# Altium schematic sheet USB.SchDoc
size A4
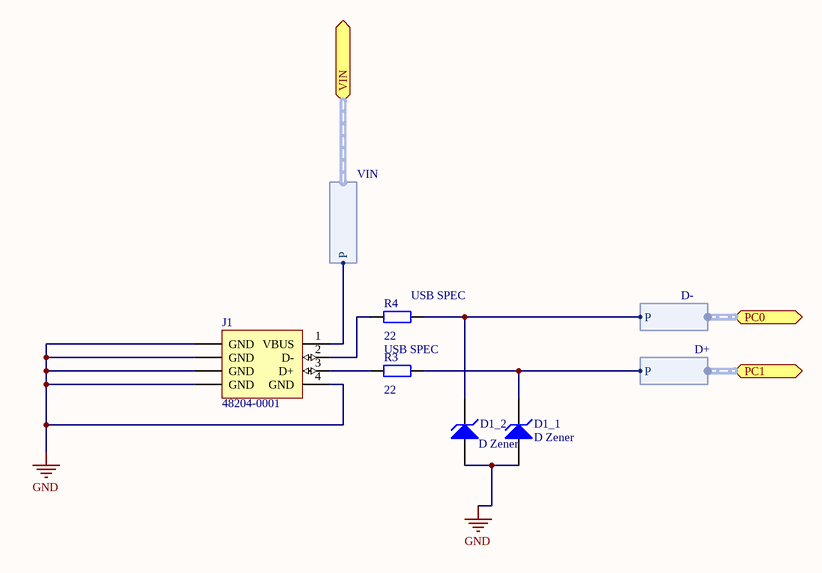
[diagram p0: USB.SchDoc]

## Parts
D1_1  D Zener  [DIODE-0.7]
D1_2  D Zener  [DIODE-0.7]
J1  48204-0001  [MOLX-48204-0001_V]
R3  USB SPEC  value 22  [AXIAL-0.4]
R4  USB SPEC  value 22  [AXIAL-0.4]

## Ports
PC0 (harness D-), PC1 (harness D+), VIN (harness VIN)

## Harnesses
VIN: P
D-: P
D+: P

## Nets
GND: D1_1.1(A) D1_2.1(A) J1.4(GND) J1.5(GND) J1.6(GND) J1.7(GND) J1.8(GND)
NetD1_1_2: D1_1.2(K) R3.2 ; port PC1.P
NetD1_2_2: D1_2.2(K) R4.2 ; port PC0.P
NetJ1_1: J1.1(VBUS) ; port VIN.P
NetJ1_2: J1.2(D-) R4.1
NetJ1_3: J1.3(D+) R3.1

## Library data of the parts
D1_1 D1_2 = D Zener: Zener Diode; Published: 8-Jun-2000; LatestRevisionDate: 17-Jul-2002; LatestRevisionNote: Re-released for DXP Platform.; PackageReference: DIODE-0.7; Publisher: Altium Limited; PackageDescription: Diode, Thru-Hole; 2 Leads; 0.7 in Pin Spacing
J1 = CMP-0411-00001-1: USB Shielded I/O Receptacle, Type A; Manufacturer: Molex; Required PB Thickness: 1.6 mm; ComponentLink1URL: http://www.molex.com/; PackageDescription: USB Type-A Up-Right Reverse Connector; PartNumber: 48204-0001; DatasheetVersion: Rev D, 04/2006; Contact Finish: Bronze; PackageReference: 48204-0001; Mounting Technology: Through Hole; ComponentLink2Description: Datasheet; ComponentLink1Description: Manufacturer URL; ComponentLink2URL: http://www.molex.com/pdm_docs/sd/482040001_sd.pdf
R3 R4 = Res2: Resistor; Published: 8-Jun-2000; LatestRevisionDate: 17-Jul-2002; LatestRevisionNote: Re-released for DXP Platform.; PackageReference: AXIAL-0.4; Publisher: Altium Limited; PackageDescription: Axial Device, Thru-Hole; 2 Leads; 0.4 in Pin Spacing